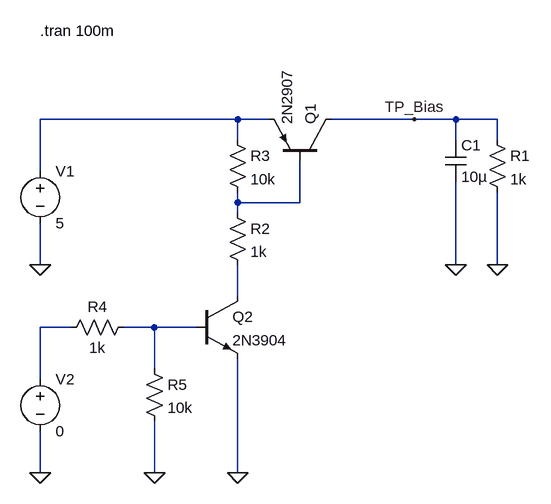
[diagram p0: schematic 4020 TX Bias Control 1.asc]
4020 TX Bias Control 1.asc, the LTspice schematic file:
Version 4
SHEET 1 880 680
WIRE 64 -288 -240 -288
WIRE 112 -288 64 -288
WIRE 336 -288 208 -288
WIRE 400 -288 336 -288
WIRE 464 -288 400 -288
WIRE 64 -256 64 -288
WIRE 400 -256 400 -288
WIRE 464 -256 464 -288
WIRE -240 -208 -240 -288
WIRE 64 -160 64 -176
WIRE 160 -160 160 -224
WIRE 160 -160 64 -160
WIRE 64 -144 64 -160
WIRE -240 -64 -240 -128
WIRE 400 -64 400 -192
WIRE 464 -64 464 -176
WIRE 64 -16 64 -64
WIRE -192 32 -240 32
WIRE -64 32 -112 32
WIRE 0 32 -64 32
WIRE -64 96 -64 32
WIRE -240 112 -240 32
WIRE -240 256 -240 192
WIRE -64 256 -64 176
WIRE 64 256 64 80
FLAG 464 -64 0
FLAG 400 -64 0
FLAG 336 -288 TP_Bias
FLAG -240 -64 0
FLAG -240 256 0
FLAG 64 256 0
FLAG -64 256 0
SYMBOL pnp 208 -224 M270
SYMATTR InstName Q1
SYMATTR Value 2N2907
SYMBOL res 448 -272 R0
SYMATTR InstName R1
SYMATTR Value 1k
SYMBOL cap 384 -256 R0
SYMATTR InstName C1
SYMATTR Value 10µ
SYMBOL res 48 -160 R0
SYMATTR InstName R2
SYMATTR Value 1k
SYMBOL res 48 -272 R0
SYMATTR InstName R3
SYMATTR Value 10k
SYMBOL voltage -240 -224 R0
WINDOW 123 0 0 Left 0
WINDOW 39 0 0 Left 0
SYMATTR InstName V1
SYMATTR Value 5
SYMBOL voltage -240 96 R0
WINDOW 123 0 0 Left 0
WINDOW 39 0 0 Left 0
SYMATTR InstName V2
SYMATTR Value 0
SYMBOL npn 0 -16 R0
SYMATTR InstName Q2
SYMATTR Value 2N3904
SYMBOL res -96 16 R90
WINDOW 0 0 56 VBottom 2
WINDOW 3 32 56 VTop 2
SYMATTR InstName R4
SYMATTR Value 1k
SYMBOL res -80 80 R0
SYMATTR InstName R5
SYMATTR Value 10k
TEXT -240 -424 Left 2 !.tran 100m

The netlist it stands for:
* 4020 TX Bias Control 1.asc
Q1 TP_Bias N002 N001 0 2N2907
R1 TP_Bias 0 1k
C1 TP_Bias 0 10µ
R2 N002 N003 1k
R3 N001 N002 10k
V1 N001 0 5
V2 N004 0 0
Q2 N003 N005 0 0 2N3904
R4 N005 N004 1k
R5 N005 0 10k
.model NPN NPN
.model PNP PNP
.lib standard.bjt
.tran 100m
.backanno
.end